# Altium project PCB.PrjPcb
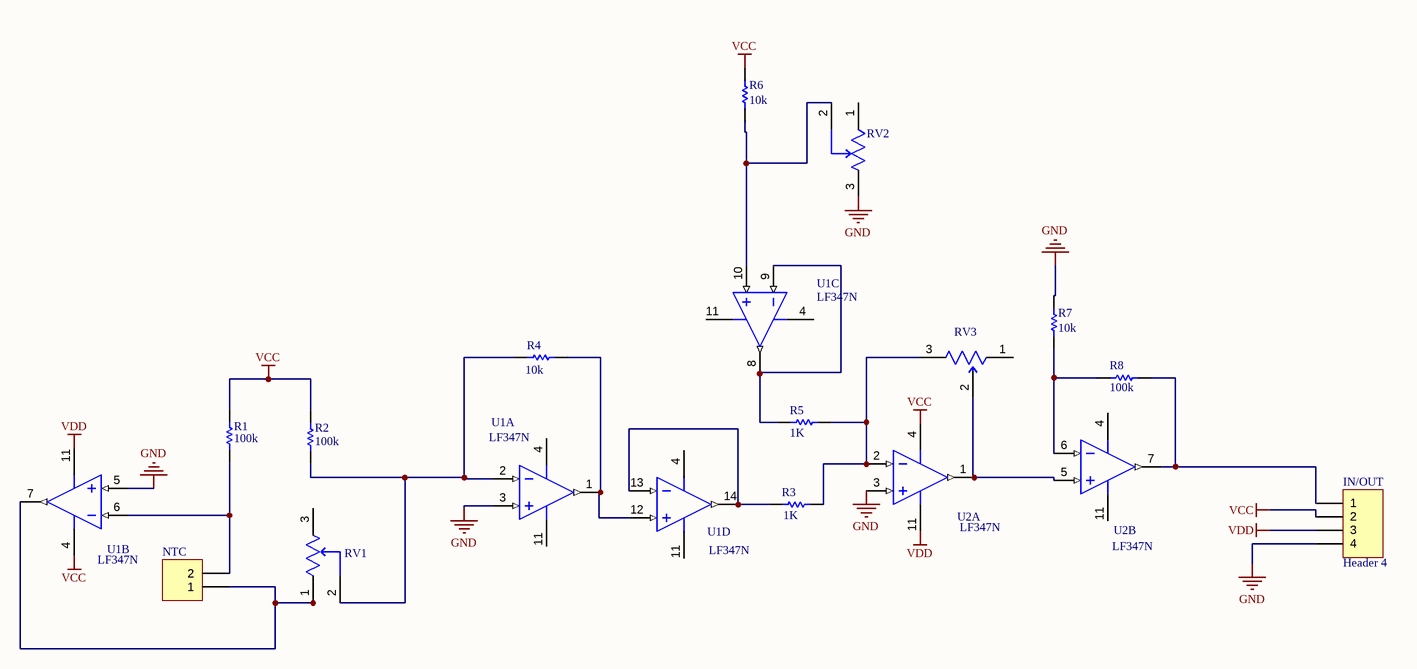
[diagram p0: NTC.SchDoc]
4 sheets, 87 parts. Net scope: global (net labels, ports and power ports of the same name join across sheets).
Board files: NTC.PcbDoc, STRAIN.PcbDoc, MICRO.PcbDoc, PS.PcbDoc
Sheets:
  NTC.SchDoc
  STRAIN.SchDoc
  PS.SchDoc
  Micro.SchDoc

## Sheet NTC.SchDoc
size 431 x 279 mm; SheetNumber: 1; SheetTotal: 4

### Parts
IN/OUT  Header 4  [HDR1X4]
NTC  Thermoresistor  [MHDR1X2]  (value not drawn)
R1  value 100k  [AXIAL-0.3]  (hidden comment: Res1)
R2  value 100k  [AXIAL-0.3]  (hidden comment: Res1)
R3  value 1K  [AXIAL-0.3]  (hidden comment: Res1)
R4  value 10k  [AXIAL-0.3]  (hidden comment: Res1)
R5  value 1K  [AXIAL-0.3]  (hidden comment: Res1)
R6  value 10k  [AXIAL-0.3]  (hidden comment: Res1)
R7  value 10k  [AXIAL-0.3]  (hidden comment: Res1)
R8  value 100k  [AXIAL-0.3]  (hidden comment: Res1)
RV1  3296W-1-504LF  [FP-3296W-MFG]  (value not drawn)
RV2  3296W-1-504LF  [FP-3296W-MFG]  (value not drawn)
RV3  3006P-1-103LF  [FP-3006P-MFG]  (value not drawn)
U1  LF347N  [N0014A]  (parts A,B,C,D of 4)
U2  LF347N  [N0014A]  (parts A,B of 4)

### Nets
GND: IN/OUT.4 R7.2 RV2.3(CW) U1.3(IN1+) U1.5(IN2+) U2.3(IN1+)
VCC: IN/OUT.2 R1.2 R2.2 R6.2 U1.4(V+) U2.4(V+)
VDD: IN/OUT.3 U1.11(V-) U2.11(V-)
NetIN/OUT_1: IN/OUT.1 R8.2 U2.7(OUT2)
NetNTC_1: NTC.1 RV1.1(CCW) U1.7(OUT2)
NetNTC_2: NTC.2 R1.1 U1.6(IN2-)
NetR2_1: R2.1 R4.1 RV1.2(WIPER) U1.2(IN1-)
NetR3_1: R3.1 U1.13(IN4-) U1.14(OUT4)
NetR3_2: R3.2 R5.2 RV3.3(CW) U2.2(IN1-)
NetR4_2: R4.2 U1.1(OUT1) U1.12(IN4+)
NetR5_1: R5.1 U1.8(OUT3) U1.9(IN3-)
NetR6_1: R6.1 RV2.2(WIPER) U1.10(IN3+)
NetR7_1: R7.1 R8.1 U2.6(IN2-)
NetRV3_2: RV3.2(WIPER) U2.1(OUT1) U2.5(IN2+)

Not connected (* = marked no-connect by the designer): RV1 3(CW); RV2 1(CCW); RV3 1(CCW)

### Notes on the sheet
- DWG. NO.
- REV.
- SHT.
- THIS DOCUMENT AND THE DATA DISCLOSED HEREIN OR HEREWITH IS THE PROPERTY OF ALTIUM LIMITED AND MAY BE FREELY DISTRIBUTED IN WHOLE. NO RIGHTS ARE RESERVED OR EXPRESS OR IMPLIED WARANTEE GIVEN.
- REVISION
- DESCRIPTION
- DATE
- APPROVED
- ENG:
- APPROVALS
- PROJECT
- DSN:
- CHK:
- REFERENCE DOCUMENTS
- PROJECT REVISION:
- TITLE
- DOCUMENT REVISION:
- DESIGN ITEM:
- BOM:
- FAB DWG:
- PCB DWG:
- ASSY DWG:
- SCALE:
- SIZE
- B
- CAGE CODE
- FILE NAME
- DWG NO.
- SHEET
- OF
- REV

### Library data of the parts
IN/OUT = Header 4: Header, 4-Pin / 1 for out / 2 for Vcc / 3 for Vdd / 4 for GND; LatestRevisionDate: 17-Jul-2002; LatestRevisionNote: Re-released for DXP Platform.; Publisher: Altium Limited
NTC = MHDR1X2: Header, 2-Pin; LatestRevisionDate: 17-Jul-2002; LatestRevisionNote: Re-released for DXP Platform.; Publisher: Altium Limited
R1-R8 = Res1: Resistor; Published: 8-Jun-2000; LatestRevisionDate: 17-Jul-2002; LatestRevisionNote: Re-released for DXP Platform.; PackageReference: AXIAL-0.3; Publisher: Altium Limited; PackageDescription: Axial Device, Thru-Hole; 2 Leads; 0.3 in Pin Spacing
RV1 RV2 = CMP-2000-05583-2: TRIMMER 500K OHM 0.5W PC PIN TOP; Manufacturer: Bourns; Resistance: 1k; Temperature Coefficient: 100ppm/°C; Value: 725; Tolerance: 10%; Voltage Rating: 300V; Standoff Height: 0.38mm; ComponentLink2Description: Datasheet; Package: 3296W; Series: Trimpot 3296-Sealed; Lead Free: Yes; Octopart: https://octopart.com/3296w-1-504lf-bourns-143884; Device Class L2: Resistors; Automotive: No; RoHS: TRUE; Temperature Range High: +125°C; Manufacturer Part Number: 3296W-1-504LF; Height: 12.05mm; Power Rating: 0.5W; Temperature Range Low: -55°C; ComponentLink2URL: https://www.bourns.com/docs/Product-Datasheets/3296.pdf; Device Class L1: Passive Components; Device Class L3: Variable Resistors and Potentiometers; Category: Res; Temperature: -55°C to +125°C; Digikey Description: TRIMMER 500K OHM 0.5W PC PIN TOP; Mouser Description: Trimmer; Cermet; Rest 500 Kilohms; PCB; 25 Turns; Pwr-Rtg 0.5W
RV3 = CMP-07234-000047-1: TRIMMER 10KOHM 0.75W PC PIN SIDE; Manufacturer Series: 3006; Pin Diameter: 0.6mm; Resistance Tolerance: 10%; Actuator Type: SCREW; Number of Turns: 15; Insulation Resistance: 1GR; Pitch: 2.5mm; Power Rating: 750mW; Resistance Law: Linear; Temperature Coefficient: 100ppm/°C; Resistance: 50k; Number of Terminals/Pins: 3; Actuator Orientation: Horizontal; Package Quantity: 100; Depth: 4.83mm; Width: 4.83mm; Termination: Pin; Packaging: Rail/Tube; Height: 6.35mm; Terminal Finish: Tin; Color: Blue; Thickness: 5.59mm; Lead Free: Lead Free; Min Operating Temperature: -55°C; Type: Potentiometer; Radiation Hardening: No; Weight: 0.04oz; Mount: Panel; RoHS Compliant: Yes; Length: 20.57mm; Tolerance: 10%; Number of Pins: 3; Taper: Linear; Military Standard: Not; Resistor Type: Cermet; Max Operating Temperature: 125°C; REACH SVHC: No SVHC; Technology: CERMET; Max Power Dissipation: 750mW; Series: 3006
U1 U2 = CMP-0055-00229-3: Wide Bandwidth Quad JFET Input Operational Amplifier, 14-pin MDIP; Manufacturer: Texas Instruments; PowerWise: N; PackageTopMarking: NSUZXYYTTE#*LF347N; CompType: Amplifiers; RoHS: N; PinCount: 14; Package Reference: N0014A; PackageDescription: MDIP, .750 x .250 x.130in, 14 Lead, .100in Pitch; ComponentLink1Description: Datasheet URL; ComponentLink1URL: http://www.ti.com/general/docs/lit/getliterature.tsp?genericPartNumber=LF347&fileType=pdf; Code_JEDEC: MS-001-AA

## Sheet STRAIN.SchDoc
size A4; SheetNumber: 2; SheetTotal: 4
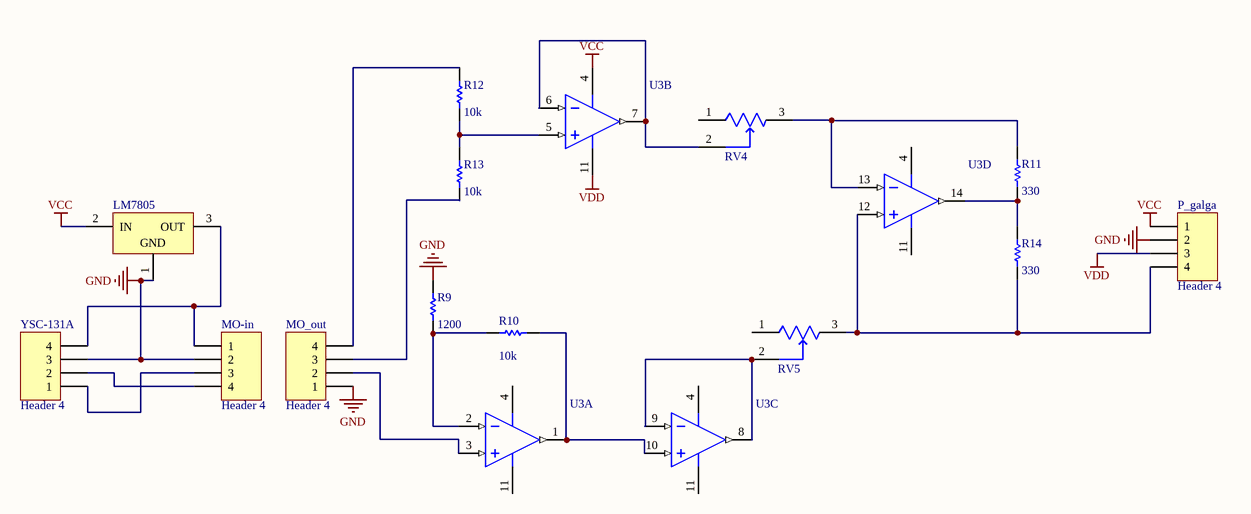
[diagram p1: STRAIN.SchDoc]

### Parts
LM7805  LM7905CT/NOPB  [NDE0003A]  (value not drawn)
MO-in  Header 4  [HDR1X4]
MO_out  Header 4  [HDR1X4]
P_galga  Header 4  [HDR1X4]
R9  value 1200  [AXIAL-0.3]  (hidden comment: Res1)
R10  value 10k  [AXIAL-0.3]  (hidden comment: Res1)
R11  value 330  [AXIAL-0.3]  (hidden comment: Res1)
R12  value 10k  [AXIAL-0.3]  (hidden comment: Res1)
R13  value 10k  [AXIAL-0.3]  (hidden comment: Res1)
R14  value 330  [AXIAL-0.3]  (hidden comment: Res1)
RV4  3296W-1-504LF  [FP-3296W-MFG]  (value not drawn)
RV5  3296W-1-504LF  [FP-3296W-MFG]  (value not drawn)
U3  LF347N  [N0014A]  (value not drawn)  (parts A,B,C,D of 4)
YSC-131A  Header 4  [HDR1X4]

### Nets
GND: LM7805.1(GND) MO-in.2 MO_out.1 P_galga.2 R9.2 YSC-131A.3
VCC: LM7805.2(IN) P_galga.1 U3.4(V+)
VDD: P_galga.3 U3.11(V-)
NetLM7805_3: LM7805.3(OUT) MO-in.1 YSC-131A.4
NetMO-in_3: MO-in.3 YSC-131A.1
NetMO-in_4: MO-in.4 YSC-131A.2
NetMO_out_2: MO_out.2 U3.3(IN1+)
NetMO_out_3: MO_out.3 R13.1
NetMO_out_4: MO_out.4 R12.2
NetP_galga_4: P_galga.4 R14.1 RV5.3(CW) U3.12(IN4+)
NetR9_1: R9.1 R10.1 U3.2(IN1-)
NetR10_2: R10.2 U3.1(OUT1) U3.10(IN3+)
NetR11_1: R11.1 R14.2 U3.14(OUT4)
NetR11_2: R11.2 RV4.3(CW) U3.13(IN4-)
NetR12_1: R12.1 R13.2 U3.5(IN2+)
NetRV4_2: RV4.2(WIPER) U3.6(IN2-) U3.7(OUT2)
NetRV5_2: RV5.2(WIPER) U3.8(OUT3) U3.9(IN3-)

Not connected (* = marked no-connect by the designer): RV4 1(CCW); RV5 1(CCW)

### Library data of the parts
LM7805 = CMP-0062-02481-3: 3-Terminal Negative Regulator, 3-pin TO-220, Pb-Free; Manufacturer: Texas Instruments; PackageTopMarking: NSUZXYTTE#*LM7905CT; CompType: LDO IC; PowerWise: N; PackageDescription: TO-220, Molded, 3 Lead, Straight; ComponentLink1Description: Datasheet URL; ComponentLink1URL: http://www.ti.com/general/docs/lit/getliterature.tsp?genericPartNumber=LM7905&fileType=pdf; PackageReference: NDE0003A; RoHS: Y; PinCount: 3
MO-in MO_out P_galga YSC-131A = Header 4: Header, 4-Pin; LatestRevisionDate: 17-Jul-2002; LatestRevisionNote: Re-released for DXP Platform.; Publisher: Altium Limited
R9-R14 = Res1: Resistor; Published: 8-Jun-2000; LatestRevisionDate: 17-Jul-2002; LatestRevisionNote: Re-released for DXP Platform.; PackageReference: AXIAL-0.3; Publisher: Altium Limited; PackageDescription: Axial Device, Thru-Hole; 2 Leads; 0.3 in Pin Spacing
RV4 RV5 = CMP-2000-05583-2: as RV1 on sheet NTC; ComponentLink2Description: Datasheet; Package: 3296W; Series: Trimpot 3296-Sealed; Lead Free: Yes; Octopart: https://octopart.com/3296w-1-504lf-bourns-143884; Device Class L2: Resistors; Automotive: No; RoHS: TRUE; Temperature Range High: +125°C; Manufacturer Part Number: 3296W-1-504LF; Height: 12.05mm; Power Rating: 0.5W; Temperature Range Low: -55°C; ComponentLink2URL: https://www.bourns.com/docs/Product-Datasheets/3296.pdf; Device Class L1: Passive Components; Device Class L3: Variable Resistors and Potentiometers; Category: Res; Temperature: -55°C to +125°C; Digikey Description: TRIMMER 500K OHM 0.5W PC PIN TOP; Mouser Description: Trimmer; Cermet; Rest 500 Kilohms; PCB; 25 Turns; Pwr-Rtg 0.5W
U3 = CMP-0055-00229-3: as U1 on sheet NTC; RoHS: N; PinCount: 14; Package Reference: N0014A; PackageDescription: MDIP, .750 x .250 x.130in, 14 Lead, .100in Pitch; ComponentLink1Description: Datasheet URL; ComponentLink1URL: http://www.ti.com/general/docs/lit/getliterature.tsp?genericPartNumber=LF347&fileType=pdf; Code_JEDEC: MS-001-AA

## Sheet PS.SchDoc
size A4; SheetNumber: 3; SheetTotal: 4; SPICEModelCacheHBBZFCVO: <root> / <DocumentId>HBBZFCVO</DocumentId> / <CacheFrame Number="0"> / <Model Name="1n4004" Kind="MDL"> / <Text>*1N4004 MCE 8-16-95 / *400V 1A Si GenPurpose Diode pkg:DIODE0.4 1,2 / .MODEL 1N4004 D(IS=2.55E-9 RS=0.042 N=1.75 TT=5.76E-6 CJO=1.85E-11 / + VJ=0.75 M=0.333 BV=400 IBV=3.95E-5 )</Text> / </Model> / </CacheFrame> / </root>
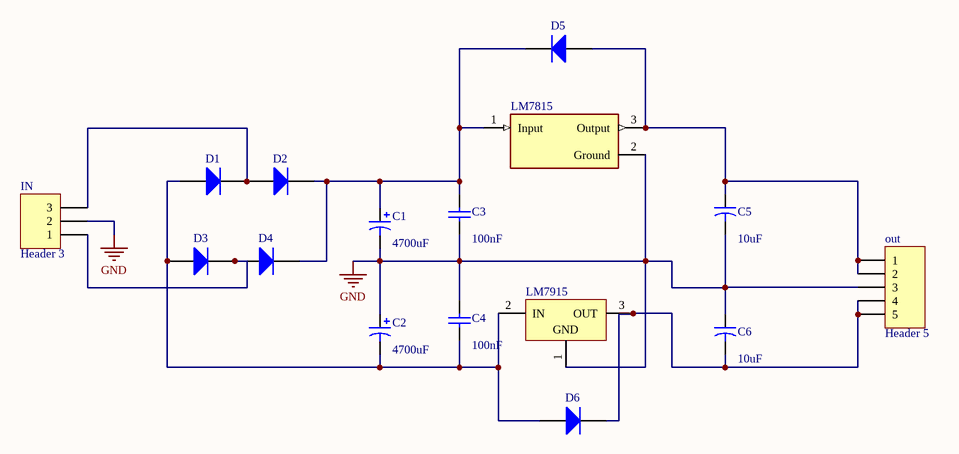
[diagram p2: PS.SchDoc]

### Parts
C1  value 4700uF  [RB7.6-15]  (hidden comment: Cap Pol1)
C2  value 4700uF  [RB7.6-15]  (hidden comment: Cap Pol1)
C3  value 100nF  [RAD-0.3]  (hidden comment: Cap)
C4  value 100nF  [RAD-0.3]  (hidden comment: Cap)
C5  value 10uF  [CAPR5-4X5]  (hidden comment: Cap2)
C6  value 10uF  [CAPR5-4X5]  (hidden comment: Cap2)
D1  Diode 1N4004  [DO-41]  (value not drawn)
D2  Diode 1N4004  [DO-41]  (value not drawn)
D3  Diode 1N4004  [DO-41]  (value not drawn)
D4  Diode 1N4004  [DO-41]  (value not drawn)
D5  Diode 1N4004  [DO-41]  (value not drawn)
D6  Diode 1N4004  [DO-41]  (value not drawn)
IN  Header 3  [HDR1X3]
LM7815  LM7815  [FP-NDE0003B-MFG]  (value not drawn)
LM7915  LM7915  [NDE0003A]  (value not drawn)
out  Header 5  [HDR1X5]

### Nets
GND: C1.2 C2.1 C3.1 C4.2 C5.2 C6.1 IN.2 LM7815.2(Ground) LM7915.1(GND) out.3
NetC1_1: C1.1 C3.2 D2.2(K) D4.2(K) D5.2(K) LM7815.1(Input)
NetC2_2: C2.2 C4.1 D1.1(A) D3.1(A) D6.1(A) LM7915.2(IN)
NetC5_1: C5.1 D5.1(A) LM7815.3(Output) out.1 out.2
NetC6_2: C6.2 D6.2(K) LM7915.3(OUT) out.4 out.5
NetD1_2: D1.2(K) D2.1(A) IN.3
NetD3_2: D3.2(K) D4.1(A) IN.1

### Library data of the parts
C1 C2 = Cap Pol1: Polarized Capacitor (Radial); Published: 8-Jun-2000; LatestRevisionDate: 17-Jul-2002; LatestRevisionNote: Re-released for DXP Platform.; PackageReference: RB7.6-15; Publisher: Altium Limited; PackageDescription: Polarized Capacitor (Radial); 2 Leads
C3 C4 = Cap: Capacitor; Published: 8-Jun-2000; LatestRevisionDate: 17-Jul-2002; LatestRevisionNote: Re-released for DXP Platform.; PackageReference: RAD-0.3; Publisher: Altium Limited; PackageDescription: Radial Cap, Thru-Hole; 2 Leads; 0.3 in Pin Spacing
C5 C6 = Cap2: Capacitor; Published: 23-Sep-2002; PackageReference: CAPR5-4X5; Publisher: Altium Limited; PackageDescription: Capacitor; 2 Leads
D1-D6 = Diode 1N4004: 1 Amp General Purpose Rectifier; Published: 8-Jun-2000; LatestRevisionDate: 17-Jul-2002; LatestRevisionNote: Re-released for DXP Platform.; DatasheetVersion: 1998; PackageVersion: Aug-1999; PackageReference: DO-41; Publisher: Altium Limited; PackageDescription: Diode, Axial; Body 5.2 x 2.7 mm (LxDia. max), Lead Dia. 0.86 mm (max); Code_JEDEC: DO-204-AL; ComponentLink1Description: Manufacturer Link; ComponentLink1URL: http://www.fairchildsemi.com/; ComponentLink2Description: Datasheet; ComponentLink2URL: http://www.fairchildsemi.com/ds/1N%2F1N4001.pdf
IN = Header 3: Header, 3-Pin; LatestRevisionDate: 17-Jul-2002; LatestRevisionNote: Re-released for DXP Platform.; Publisher: Altium Limited
LM7815 = CMP-04917-000014-1: pin 1 in / pin 2 GND / pin 3 out; Manufacturer Part Number: LM7815CT/NOPB; Manufacturer: Texas Instruments; Accuracy Percentage: 3%; Nominal Supply Current: 8mA; Standoff Height: 3.3mm; Min Supply Voltage: 7.5V; Number Of Outputs: 1; Max Supply Voltage: 30V; Output Voltage: 15V; Dropout Voltage: 2V; Output Current: 1.5A; Output Type: Fixed; Max Junction Temp: +150°C; Device Class L2: Power Management ICs; Temperature: 0°C to +125°C; Automotive: No; ComponentLink2URL: http://www.ti.com/lit/ds/symlink/lm7800.pdf; Lead Free: Yes; Temperature Range High: +125°C; Digikey Description: IC REG LINEAR 15V 1A TO220-3; Package: NDE0003B; Ipc Land Pattern Name: TO-220; Category: IC; Device Class L3: Voltage Regulators - Linear; RoHS: TRUE; ComponentLink2Description: Datasheet; Height: 19.55mm; Temperature Range Low: 0°C; Device Class L1: Integrated Circuits (ICs); Mouser Description: Linear Voltage Regulators 15 Volt Reg; Octopart: https://octopart.com/lm7815ct%2Fnopb-texas+instruments-23919376
LM7915 = CMP-0062-02469-3: pin 3 out / pin 2 in / pin 1 GND; Manufacturer: Texas Instruments; PackageTopMarking: NSUZXYTTE#*LM7915CT; PowerWise: N; CompType: LDO IC; PackageReference: NDE0003A; PackageDescription: TO-220, Molded, 3 Lead, Straight; ComponentLink1Description: Datasheet URL; PinCount: 3; RoHS: Y; ComponentLink1URL: http://www.ti.com/general/docs/lit/getliterature.tsp?genericPartNumber=LM7915&fileType=pdf
out = Header 5: Header, 5-Pin; LatestRevisionDate: 17-Jul-2002; LatestRevisionNote: Re-released for DXP Platform.; Publisher: Altium Limited

## Sheet Micro.SchDoc
size 420 x 297 mm; SheetNumber: 4; SheetTotal: 4; SPICEModelCacheVGPYFBXO: <root> / <DocumentId>VGPYFBXO</DocumentId> / <CacheFrame Number="0"> / <Model Name="1n4004" Kind="MDL"> / <Text>*1N4004 MCE 8-16-95 / *400V 1A Si GenPurpose Diode pkg:DIODE0.4 1,2 / .MODEL 1N4004 D(IS=2.55E-9 RS=0.042 N=1.75 TT=5.76E-6 CJO=1.85E-11 / + VJ=0.75 M=0.333 BV=400 IBV=3.95E-5 )</Text> / </Model> / </CacheFrame> / </root>
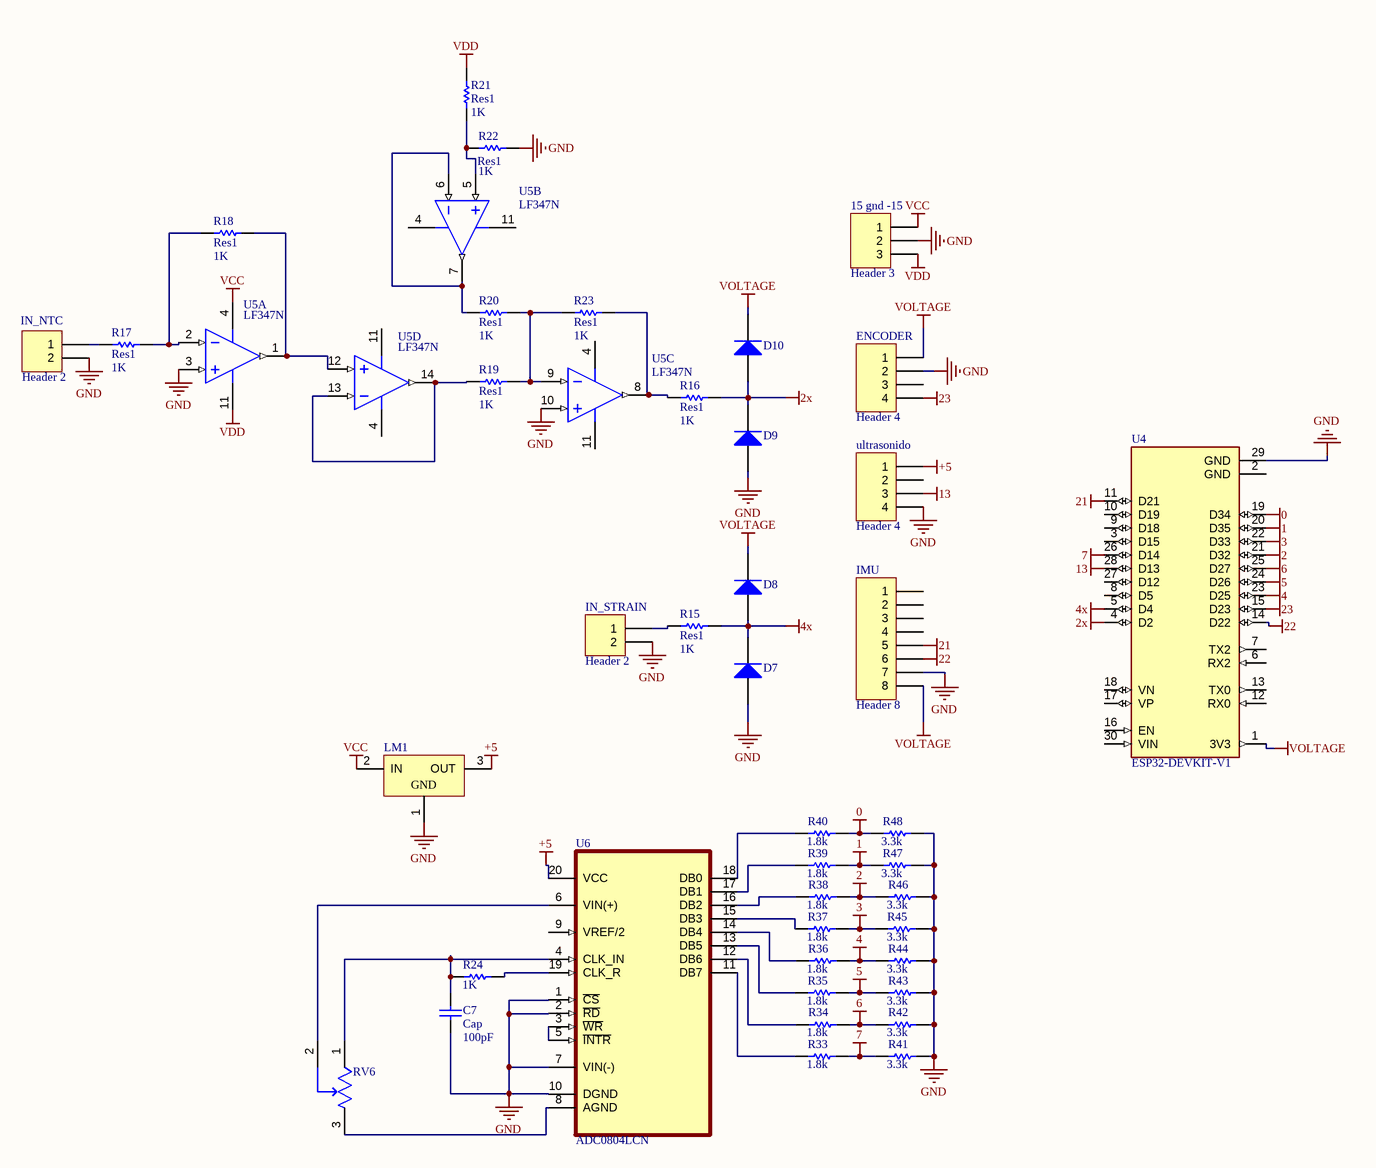
[diagram p3: Micro.SchDoc]

### Parts
15_gnd_-15  Header 3  [HDR1X3]
C7  Cap  value 100pF  [RAD-0.3]
D7  Diode 1N4004  [DO-41]  (value not drawn)
D8  Diode 1N4004  [DO-41]  (value not drawn)
D9  Diode 1N4004  [DO-41]  (value not drawn)
D10  Diode 1N4004  [DO-41]  (value not drawn)
ENCODER  Header 4  [HDR1X4]
IMU  Header 8  [HDR1X8]
IN_NTC  Header 2  [HDR1X2]
IN_STRAIN  Header 2  [HDR1X2]
LM1  LM7905CT/NOPB  [NDE0003A]  (value not drawn)
R15  Res1  value 1K  [AXIAL-0.3]
R16  Res1  value 1K  [AXIAL-0.3]
R17  Res1  value 1K  [AXIAL-0.3]
R18  Res1  value 1K  [AXIAL-0.3]
R19  Res1  value 1K  [AXIAL-0.3]
R20  Res1  value 1K  [AXIAL-0.3]
R21  Res1  value 1K  [AXIAL-0.3]
R22  Res1  value 1K  [AXIAL-0.3]
R23  Res1  value 1K  [AXIAL-0.3]
R24  value 1K  [AXIAL-0.3]  (hidden comment: Res1)
R33  value 1.8k  [AXIAL-0.3]  (hidden comment: Res1)
R34  value 1.8k  [AXIAL-0.3]  (hidden comment: Res1)
R35  value 1.8k  [AXIAL-0.3]  (hidden comment: Res1)
R36  value 1.8k  [AXIAL-0.3]  (hidden comment: Res1)
R37  value 1.8k  [AXIAL-0.3]  (hidden comment: Res1)
R38  value 1.8k  [AXIAL-0.3]  (hidden comment: Res1)
R39  value 1.8k  [AXIAL-0.3]  (hidden comment: Res1)
R40  value 1.8k  [AXIAL-0.3]  (hidden comment: Res1)
R41  value 3.3k  [AXIAL-0.3]  (hidden comment: Res1)
R42  value 3.3k  [AXIAL-0.3]  (hidden comment: Res1)
R43  value 3.3k  [AXIAL-0.3]  (hidden comment: Res1)
R44  value 3.3k  [AXIAL-0.3]  (hidden comment: Res1)
R45  value 3.3k  [AXIAL-0.3]  (hidden comment: Res1)
R46  value 3.3k  [AXIAL-0.3]  (hidden comment: Res1)
R47  value 3.3k  [AXIAL-0.3]  (hidden comment: Res1)
R48  value 3.3k  [AXIAL-0.3]  (hidden comment: Res1)
RV6  3296W-1-504LF  [FP-3296W-MFG]  (value not drawn)
U4  ESP32-DEVKIT-V1  [MODULE_ESP32_DEVKIT_V1]
U5  LF347N  [N0014A]  (parts A,B,C,D of 4)
U6  ADC0804LCN  [DIP254P762X508-20]
ultrasonido  Header 4  [HDR1X4]

### Nets
0: R40.2 R48.1 U4.19(D34)
1: R39.2 R47.1 U4.20(D35)
2: R38.2 R46.1 U4.21(D32)
2x: D9.2(K) D10.1(A) R16.2 U4.4(D2)
3: R37.2 R45.1 U4.22(D33)
4: R36.2 R44.1 U4.23(D25)
4x: D7.2(K) D8.1(A) R15.2 U4.5(D4)
5: R35.2 R43.1 U4.24(D26)
6: R34.2 R42.1 U4.25(D27)
7: R33.2 R41.1 U4.26(D14)
13: U4.28(D13) ultrasonido.3
21: IMU.5 U4.11(D21)
22: IMU.6 U4.14(D22)
23: ENCODER.4 U4.15(D23)
+5: LM1.3(OUT) U6.20(VCC) ultrasonido.1
GND: 15_gnd_-15.2 C7.2 D7.1(A) D9.1(A) ENCODER.2 IMU.7 IN_NTC.2 IN_STRAIN.2 LM1.1(GND) R22.2 R41.2 R42.2 R43.2 R44.2 R45.2 R46.2 R47.2 R48.2 U4.29(GND) U5.3(IN1+) U5.10(IN3+) U6.1(~{CS}) U6.2(~{RD}) U6.7(VIN(-)) U6.10(DGND) ultrasonido.4
VCC: 15_gnd_-15.1 LM1.2(IN) U5.4(V+)
VDD: 15_gnd_-15.3 R21.2 U5.11(V-)
VOLTAGE: D8.2(K) D10.2(K) ENCODER.1 IMU.8 U4.1(3V3)
NetC7_1: C7.1 R24.1 RV6.1(CCW) U6.4(CLK_IN)
NetIN_NTC_1: IN_NTC.1 R17.1
NetIN_STRAIN_1: IN_STRAIN.1 R15.1
NetR16_1: R16.1 R23.2 U5.8(OUT3)
NetR17_2: R17.2 R18.1 U5.2(IN1-)
NetR18_2: R18.2 U5.1(OUT1) U5.12(IN4+)
NetR19_1: R19.1 U5.13(IN4-) U5.14(OUT4)
NetR19_2: R19.2 R20.2 R23.1 U5.9(IN3-)
NetR20_1: R20.1 U5.6(IN2-) U5.7(OUT2)
NetR21_1: R21.1 R22.1 U5.5(IN2+)
NetR24_2: R24.2 U6.19(CLK_R)
NetR33_1: R33.1 U6.11(DB7)
NetR34_1: R34.1 U6.12(DB6)
NetR35_1: R35.1 U6.13(DB5)
NetR36_1: R36.1 U6.14(DB4)
NetR37_1: R37.1 U6.15(DB3)
NetR38_1: R38.1 U6.16(DB2)
NetR39_1: R39.1 U6.17(DB1)
NetR40_1: R40.1 U6.18(DB0)
NetRV6_2: RV6.2(WIPER) U6.6(VIN(+))
NetRV6_3: RV6.3(CW) U6.8(AGND)
NetU6_3: U6.3(~{WR}) U6.5(~{INTR})

Not connected (* = marked no-connect by the designer): ENCODER 3; IMU 1 2 3 4; U4 2(GND) 3(D15) 6(RX2) 7(TX2) 8(D5) 9(D18) 10(D19) 12(RX0) 13(TX0) 16(EN) 17(VP) 18(VN) 27(D12) 30(VIN); U6 9(VREF/2); ultrasonido 2

### Notes on the sheet
- THIS DOCUMENT AND THE DATA DISCLOSED HEREIN OR
- HEREWITH IS THE PROPERTY OF ALTIUM LIMITED AND MAY
- DWG NO:
- REVISION
- REV:
- DESCRIPTION
- DATE
- APPROVED
- BE FREELY DISTRIBUTED IN WHOLE. NO RIGHTS ARE
- RESERVED OR EXPRESS OR IMPLIED WARANTEE GIVEN.
- ENG:
- APPROVALS
- PROJECT
- DSN:
- CHK:
- REFERENCE DOCUMENTS
- PROJECT REVISION:
- TITLE
- DOCUMENT REVISION:
- DESIGN ITEM:
- BOM:
- FAB DWG:
- PCB DWG:
- ASSY DWG:
- SCALE:
- A3
- SIZE
- CAGE CODE
- FILE NAME
- DWG NO.
- SHEET
- OF
- REV

### Library data of the parts
15_gnd_-15 = Header 3: Header, 3-Pin; LatestRevisionDate: 17-Jul-2002; LatestRevisionNote: Re-released for DXP Platform.; Publisher: Altium Limited
C7 = Cap: Capacitor; Published: 8-Jun-2000; LatestRevisionDate: 17-Jul-2002; LatestRevisionNote: Re-released for DXP Platform.; PackageReference: RAD-0.3; Publisher: Altium Limited; PackageDescription: Radial Cap, Thru-Hole; 2 Leads; 0.3 in Pin Spacing
D7-D10 = Diode 1N4004: 1 Amp General Purpose Rectifier; Published: 8-Jun-2000; LatestRevisionDate: 17-Jul-2002; LatestRevisionNote: Re-released for DXP Platform.; DatasheetVersion: 1998; PackageVersion: Aug-1999; PackageReference: DO-41; Publisher: Altium Limited; PackageDescription: Diode, Axial; Body 5.2 x 2.7 mm (LxDia. max), Lead Dia. 0.86 mm (max); Code_JEDEC: DO-204-AL; ComponentLink1Description: Manufacturer Link; ComponentLink1URL: http://www.fairchildsemi.com/; ComponentLink2Description: Datasheet; ComponentLink2URL: http://www.fairchildsemi.com/ds/1N%2F1N4001.pdf
ENCODER ultrasonido = Header 4: Header, 4-Pin; LatestRevisionDate: 17-Jul-2002; LatestRevisionNote: Re-released for DXP Platform.; Publisher: Altium Limited
IMU = Header 8: Header, 8-Pin; LatestRevisionDate: 17-Jul-2002; LatestRevisionNote: Re-released for DXP Platform.; Publisher: Altium Limited
IN_NTC IN_STRAIN = Header 2: Header, 2-Pin; LatestRevisionDate: 17-Jul-2002; LatestRevisionNote: Re-released for DXP Platform.; Publisher: Altium Limited
LM1 = CMP-0062-02481-3: as LM7805 on sheet STRAIN; PackageDescription: TO-220, Molded, 3 Lead, Straight; ComponentLink1Description: Datasheet URL; ComponentLink1URL: http://www.ti.com/general/docs/lit/getliterature.tsp?genericPartNumber=LM7905&fileType=pdf; PackageReference: NDE0003A; RoHS: Y; PinCount: 3
R15-R24 R33-R48 = Res1: Resistor; Published: 8-Jun-2000; LatestRevisionDate: 17-Jul-2002; LatestRevisionNote: Re-released for DXP Platform.; PackageReference: AXIAL-0.3; Publisher: Altium Limited; PackageDescription: Axial Device, Thru-Hole; 2 Leads; 0.3 in Pin Spacing
RV6 = CMP-2000-05583-2: as RV1 on sheet NTC; ComponentLink2Description: Datasheet; Package: 3296W; Series: Trimpot 3296-Sealed; Lead Free: Yes; Octopart: https://octopart.com/3296w-1-504lf-bourns-143884; Device Class L2: Resistors; Automotive: No; RoHS: TRUE; Temperature Range High: +125°C; Manufacturer Part Number: 3296W-1-504LF; Height: 12.05mm; Power Rating: 0.5W; Temperature Range Low: -55°C; ComponentLink2URL: https://www.bourns.com/docs/Product-Datasheets/3296.pdf; Device Class L1: Passive Components; Device Class L3: Variable Resistors and Potentiometers; Category: Res; Temperature: -55°C to +125°C; Digikey Description: TRIMMER 500K OHM 0.5W PC PIN TOP; Mouser Description: Trimmer; Cermet; Rest 500 Kilohms; PCB; 25 Turns; Pwr-Rtg 0.5W
U4 = ESP32-DEVKIT-V1: Dual core, Wi-Fi: 2.4 GHz up to 150 Mbits/s,BLE (Bluetooth Low Energy) and legacy Bluetooth, 32 bits, Up to 240 MHz; MF: Do it; Price: None; Availability: Not in stock; Package: None; MP: ESP32-DEVKIT-V1; Value: *; SnapEDA_Link: https://www.snapeda.com/parts/ESP32-DEVKIT-V1/Do+it/view-part/?ref=snap; Check_prices: https://www.snapeda.com/parts/ESP32-DEVKIT-V1/Do+it/view-part/?ref=eda
U5 = CMP-0055-00229-3: as U1 on sheet NTC; RoHS: N; PinCount: 14; Package Reference: N0014A; PackageDescription: MDIP, .750 x .250 x.130in, 14 Lead, .100in Pitch; ComponentLink1Description: Datasheet URL; ComponentLink1URL: http://www.ti.com/general/docs/lit/getliterature.tsp?genericPartNumber=LF347&fileType=pdf; Code_JEDEC: MS-001-AA
U6 = ADC0804LCN: 8 Bit Analog to Digital Converter 1 Input 1 SAR 20-DIP; MF: Renesas Electronics; MP: ADC0804LCN; Price: None; Availability: Unavailable; SnapEDA_Link: https://www.snapeda.com/parts/ADC0804LCN/Renesas%20Electronics%20America%20Inc./view-part/28050/?ref=snap; Value: *; Package: DIP-20 Texas Instruments

## Nets that join several sheets
GND: NTC (6 pins), STRAIN (6 pins), PS (10 pins), Micro (26 pins)
VCC: NTC (6 pins), STRAIN (LM7805.2 P_galga.1 U3.4), Micro (15_gnd_-15.1 LM1.2 U5.4)
VDD: NTC (IN/OUT.3 U1.11 U2.11), STRAIN (P_galga.3 U3.11), Micro (15_gnd_-15.3 R21.2 U5.11)